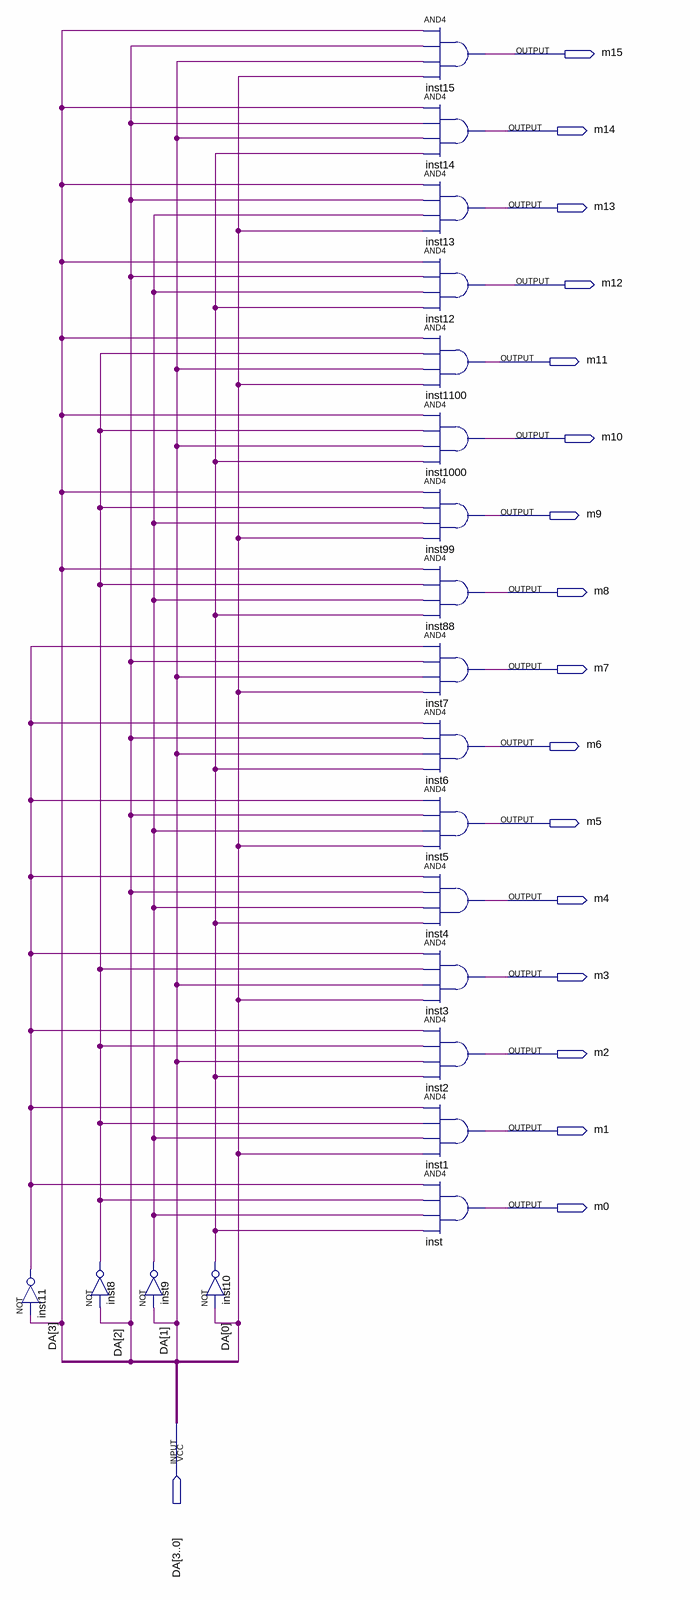
[diagram p0: schematic sheet]
// Quartus schematic 4to16_Decoder.bdf as structural Verilog: 20 symbols, 17 pins
module \4to16_Decoder  (
  input  [3:0] DA,
  output m15,
  output m14,
  output m13,
  output m12,
  output m11,
  output m10,
  output m9,
  output m8,
  output m7,
  output m6,
  output m5,
  output m4,
  output m3,
  output m2,
  output m1,
  output m0
);

  wire inst8_out, inst9_out, inst10_out, inst11_out;

  not inst11 (inst11_out, DA[3]);
  not inst8 (inst8_out, DA[2]);
  not inst9 (inst9_out, DA[1]);
  not inst10 (inst10_out, DA[0]);
  and inst15 (m15, DA[3], DA[2], DA[1], DA[0]);
  and inst14 (m14, DA[3], DA[2], DA[1], inst10_out);
  and inst13 (m13, DA[3], DA[2], inst9_out, DA[0]);
  and inst12 (m12, DA[3], DA[2], inst9_out, inst10_out);
  and inst1100 (m11, DA[3], inst8_out, DA[1], DA[0]);
  and inst1000 (m10, DA[3], inst8_out, DA[1], inst10_out);
  and inst99 (m9, DA[3], inst8_out, inst9_out, DA[0]);
  and inst88 (m8, DA[3], inst8_out, inst9_out, inst10_out);
  and inst7 (m7, inst11_out, DA[2], DA[1], DA[0]);
  and inst6 (m6, inst11_out, DA[2], DA[1], inst10_out);
  and inst5 (m5, inst11_out, DA[2], inst9_out, DA[0]);
  and inst4 (m4, inst11_out, DA[2], inst9_out, inst10_out);
  and inst3 (m3, inst11_out, inst8_out, DA[1], DA[0]);
  and inst2 (m2, inst11_out, inst8_out, DA[1], inst10_out);
  and inst1 (m1, inst11_out, inst8_out, inst9_out, DA[0]);
  and inst (m0, inst11_out, inst8_out, inst9_out, inst10_out);
endmodule
